# EAGLE design SparkFun_Qwiic_Micro_Barometer_LPS28DFW (EAGLE 9.6.2)
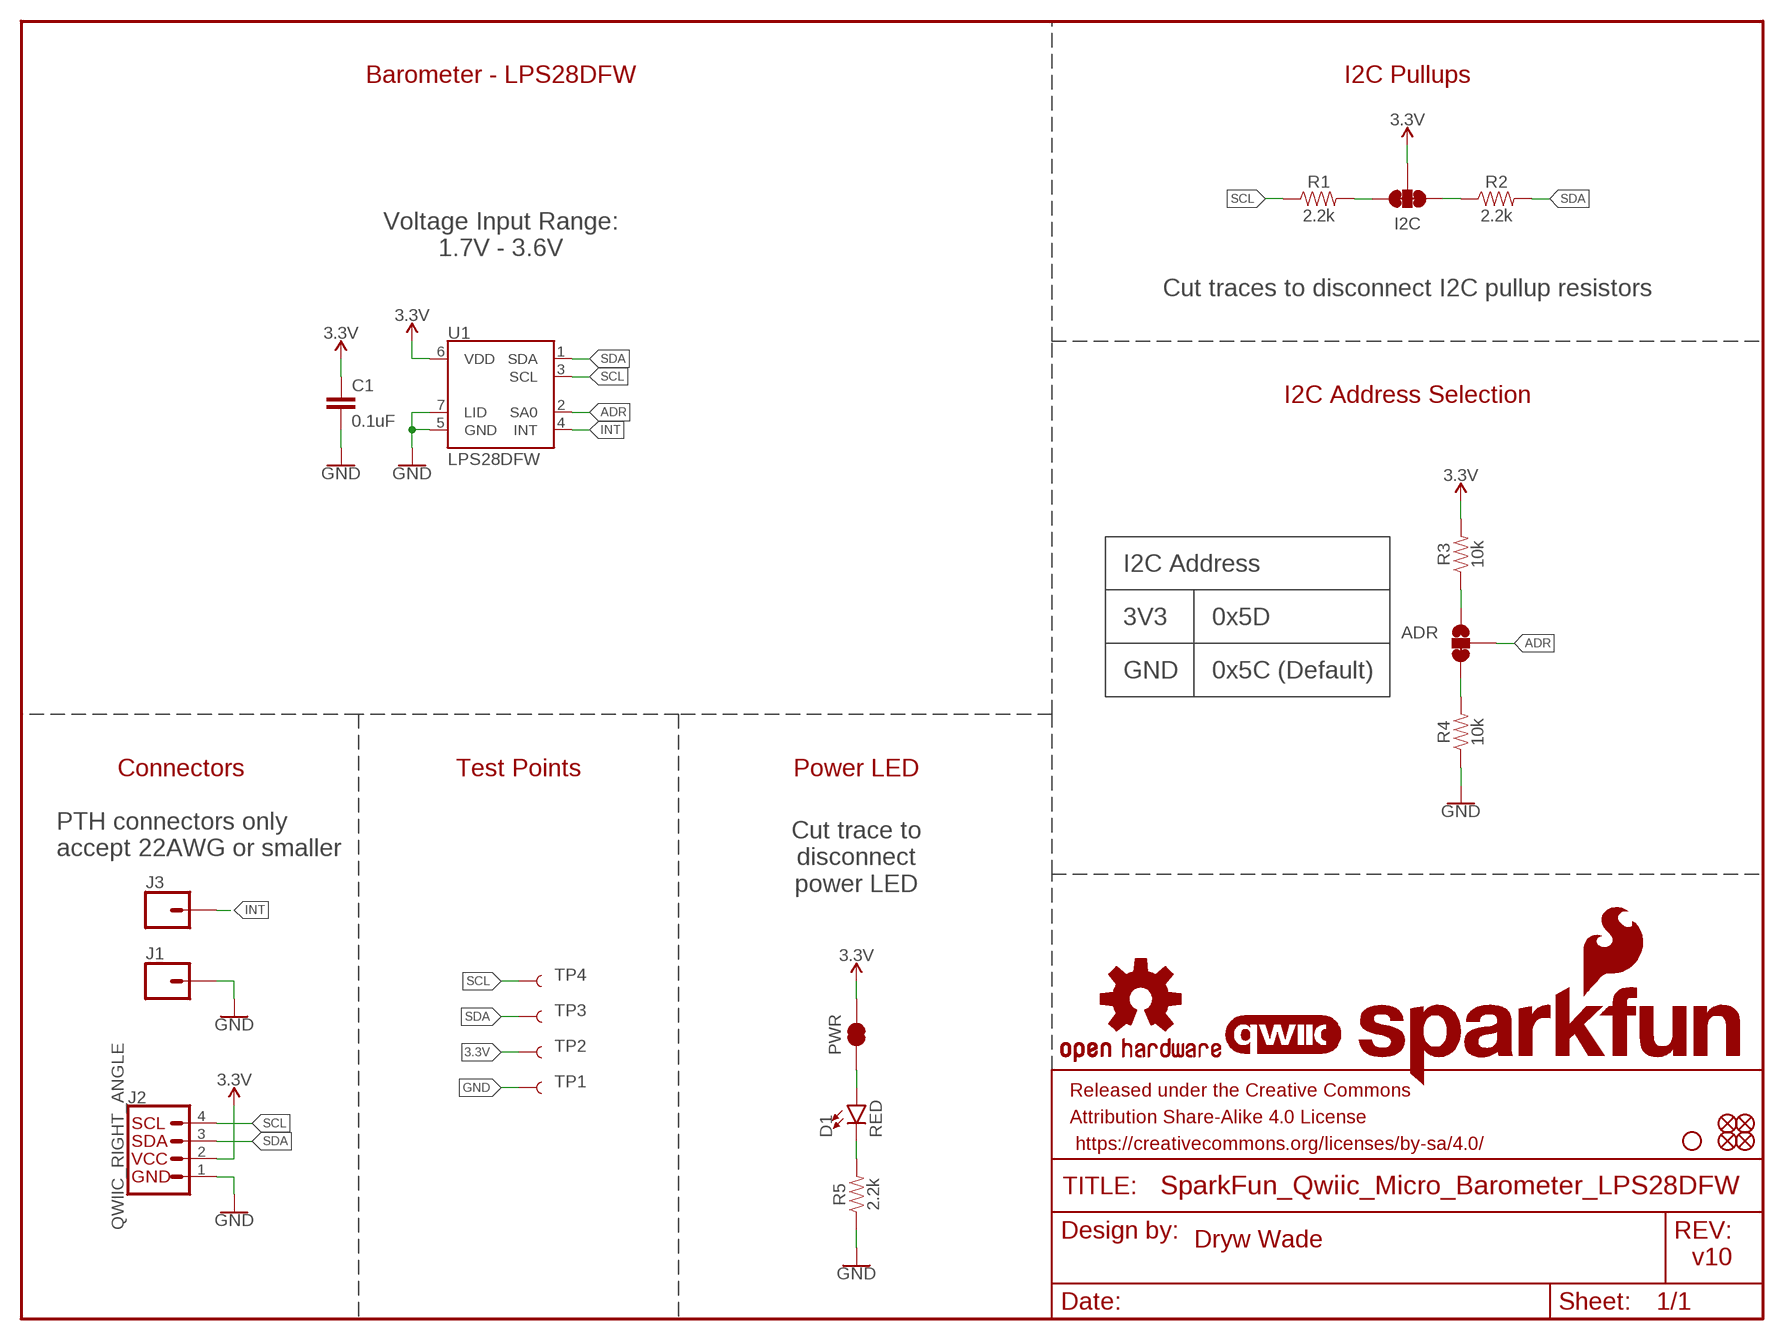
[diagram p0: schematic, sheet 1]

## Parts
ADR  JUMPER-SMT_3_1-NC_TRACE_SILK  [SMT-JUMPER_3_1-NC_TRACE_SILK]
C1  0.1uF  0.1UF-0402T-16V-10%  [0402-TIGHT]
D1  RED  LED-RED_0402  [LED-0402]
FD1  FIDUCIALUFIDUCIAL  [FIDUCIAL-MICRO]
FD2  FIDUCIALUFIDUCIAL  [FIDUCIAL-MICRO]
FD3  FIDUCIALUFIDUCIAL  [FIDUCIAL-MICRO]
FD4  FIDUCIALUFIDUCIAL  [FIDUCIAL-MICRO]
FRAME1  FRAME-LETTER  [CREATIVE_COMMONS]
H1  STAND-OFF  [STAND-OFF]
I2C  JUMPER-SMT_3_2-NC_TRACE_SILK  [SMT-JUMPER_3_2-NC_TRACE_SILK]
J1  CONN_01_1MM  [1X01_1MM_NO_SILK]
J2  QWIIC_RIGHT_ANGLE  QWIIC_CONNECTORJS-1MM  [JST04_1MM_RA]
J3  CONN_01_1MM  [1X01_1MM_NO_SILK]
LOGO1  OSHW-LOGOS  [OSHW-LOGO-S]
LOGO2  QWIIC_LOGO_3MM  [QWIIC_3MM]
LOGO3  SFE_LOGO_NAME_FLAMEBLANK  [BLANK]
PWR  JUMPER-SMT_2_NC_TRACE_SILK  [SMT-JUMPER_2_NC_TRACE_SILK]
R1  2.2k  2.2KOHM-0402T-1/16W-1%  [0402-TIGHT]
R2  2.2k  2.2KOHM-0402T-1/16W-1%  [0402-TIGHT]
R3  10k  10KOHM-0402T-1/16W-1%  [0402-TIGHT]
R4  10k  10KOHM-0402T-1/16W-1%  [0402-TIGHT]
R5  2.2k  2.2KOHM-0402T-1/16W-1%  [0402-TIGHT]
TP1  TEST-POINT3  [PAD.03X.03]
TP2  TEST-POINT3  [PAD.03X.03]
TP3  TEST-POINT3  [PAD.03X.03]
TP4  TEST-POINT3  [PAD.03X.03]
U1  LPS28DFW  [CCLGA-7L]

## Nets
3.3V: C1.1 I2C.2 J2.2 PWR.2 R3.2 TP2.1 U1.6(VDD)
ADR: ADR.2 U1.2(SA0)
GND: C1.2 J1.1 J2.1 R4.1 R5.1 TP1.1 U1.5(GND) U1.7(LID)
INT: J3.1 U1.4(INT)
N$1: D1.C R5.2
N$2: I2C.3 R1.2
N$3: I2C.1 R2.1
N$4: D1.A PWR.1
N$5: ADR.3 R4.2
N$6: ADR.1 R3.1
SCL: J2.4 R1.1 TP4.1 U1.3(SCL)
SDA: J2.3 R2.2 TP3.1 U1.1(SDA)

## Notes on the sheet
- Barometer - LPS28DFW | I2C Pullups
- Voltage Input Range:
  1.7V - 3.6V
- Cut traces to disconnect I2C pullup resistors
- I2C Address Selection
- I2C Address
- 3V3 | 0x5D
- GND | 0x5C (Default)
- Connectors | Test Points | Power LED
- PTH connectors only
  accept 22AWG or smaller
- Cut trace to
  disconnect
  power LED
- Dryw Wade
- v10

## Library data of the parts
ADR = SparkFun-Jumpers:JUMPER-SMT_3_1-NC_TRACE: Normally closed trace jumper (1 of 2 connections) This jumper has a trace between two pads so it's normally closed (NC). The other connection is normally open (NO). Use a razor knife to open the connection. For best results follow the IPC guidelines for cutting traces: Cutout at least 0.063 mm (0.005 in). Remove all loose material to clean up the cut area. Seal the cut with an approved epoxy. Reapply solder to reclose the connection, or to close the NO connection.
C1 = SparkFun-Capacitors:0.1UF: 0.1µF ceramic capacitors A capacitor is a passive two-terminal electrical component used to store electrical energy temporarily in an electric field.; PROD_ID: CAP-12416
D1 = SparkFun-LED:LED-RED: Red SMD LED Used in manufacturing of most products at SparkFun Packages: 0603 - SMD 0603 package [Product Link] <http://docs.avagotech.com/docs/AV02-0551EN> 0603 SMART - SMD 0603 SMART package ( more efficient and expensive)[Product Link] <http://www.osram-os.com/Graphics/XPic2/00077099_0.pdf> 1206 - SMD1206 package [Product Link] <https://www.sparkfun.com/datasheets/DevTools/LilyPad/Q150OVS4.pdff> SparkFun Products: Pro Mini 328 -5V <https://www.sparkfun.com/products/821> RedBoard <https://www.sparkfun.com/products/12757> IOIO-OTG <https://www.sparkfun.com/products/13613>; PROD_ID: DIO-16757
FD1-FD4 = SparkFun-Aesthetics:FIDUCIAL: Fiducial Alignment Points Point-of-reference for pick-and-place machines and other optical instruments.
FRAME1 = SparkFun-Aesthetics:FRAME-LETTER: Schematic Frame - Letter Standard 8.5x11 US Letter frame
H1 = SparkFun-Hardware:STAND-OFF: Stand Off Drill holes for mechanically mounting via screws, standoffs, etc. Note: Use the keepout ring to avoid running the screw head into surrounding components. Variant Overviews STAND-OFF - Mechanical footprint for a #4 phillips button head screw. STAND-OFF-TIGHT - Mechanical footprint for a #4 phillips button head screw, Example SparkFun Products Screw - Phillips Head (1/4", 4-40, 10 pack) <https://www.sparkfun.com/products/10453> (PRT-10453) Screw - Phillips Head (1/2", 4-40, 10 pack) <https://www.sparkfun.com/products/10452> (PRT-10452) Screw - Phillips Head (3/4", 4-40, 10 pack) <https://www.sparkfun.com/products/10451> (PRT-10451) Screw - Phillips Head (1", 4-40, 10 pack) <https://www.sparkfun.com/products/10450> (PRT-10450)
I2C = SparkFun-Jumpers:JUMPER-SMT_3_2-NC_TRACE: Normally closed trace jumper (2 of 2 connections) This jumper has a trace between all three pads so they are normally closed (NC). Use a razor knife to open the connection(s). For best results follow the IPC guidelines for cutting traces: Cutout at least 0.063 mm (0.005 in). Remove all loose material to clean up the cut area. Seal the cut with an approved epoxy. Reapply solder to reclose the connection(s).
J1 J3 = SparkFun-Connectors:CONN_01: Single connection point. Often used as Generic Header-pin footprint for 0.1 inch spaced/style header connections On any of the 0.1 inch spaced packages, you can populate with these: Break Away Headers - Straight <https://www.sparkfun.com/products/116> (PRT-00116) Break Away Male Headers - Right Angle <https://www.sparkfun.com/products/553> (PRT-00553) Female Headers <https://www.sparkfun.com/products/115> (PRT-00115) Break Away Headers - Machine Pin <https://www.sparkfun.com/products/117> (PRT-00117) Break Away Female Headers - Swiss Machine Pin <https://www.sparkfun.com/products/743> (PRT-00743) This device is also useful as a general connection point to wire up your design to another part of your project. Our various solder wires solder well into these plated through hole pads. Hook-Up Wire - Assortment (Stranded, 22 AWG) <https://www.sparkfun.com/products/11375> (PRT-11375) Hook-Up Wire - Assortment (Solid Core, 22 AWG) <https://www.sparkfun.com/products/11367> (PRT-11367) View the entire wire category on our website here <https://www.sparkfun.com/categories/141> Special notes: SMTSO-256-ET is a "flush mount" nut for a 4-40 screw. We mostly use this on specialty testbeds; it is a nice way to connect hardware to your PCB at an adjustable hieght. Also note, the SNAP packages are for using a snappable style connector. We sell a baggie of snaps and they are also used on two LilyPad designs: Snap Assortment - 30 pack (male and female) <https://www.sparkfun.com/products/11347> (DEV-11347) LilyPad Arduino SimpleSnap <https://www.sparkfun.com/products/10941> (DEV-10941) LilyPad SimpleSnap Protoboard <https://www.sparkfun.com/products/10940> (DEV-10940)
J2 = SparkFun-Connectors:QWIIC_CONNECTOR: SparkFun I2C Standard Qwiic Connector An SMD 1mm pitch JST connector makes it easy and quick (get it? Qwiic?) to connect I2C devices to each other. The Qwiic system <http://www.sparkfun.com/qwiic> enables fast and solderless connection between popular platforms and various sensors and actuators. We carry 200mm <https://www.sparkfun.com/products/14204>, 100mm <https://www.sparkfun.com/products/14205>, 50mm <https://www.sparkfun.com/products/14206>, and breadboard friendly <https://www.sparkfun.com/products/14207> Qwiic cables. We also offer 10 pcs strips <https://www.sparkfun.com/products/14323> the SMD connectors.; PROD_ID: CONN-13694
LOGO1 = SparkFun-Aesthetics:OSHW-LOGO: Open-Source Hardware (OSHW) Logo This logo indicates the piece of hardware it is found on incorporates a OSHW license and/or adheres to the definition of open source hardware found here: http://freedomdefined.org/OSHW
LOGO2 = SparkFun-Aesthetics:QWIIC_LOGO: Qwiic Logos for placement on schematic and PCB. The 5.5mm silk logo is best for placing next to Qwiic connector.
LOGO3 = SparkFun-Aesthetics:SFE_LOGO_NAME_FLAME: SparkFun Font Logo w/ Flame This is the SparkFun full logo. The logo on the schematic will always be the same size; the package variant is the height of the flame part of the logo. Default layer for the logo on the board is tSilk.
PWR = SparkFun-Jumpers:JUMPER-SMT_2_NC_TRACE: Normally closed trace jumper This jumper has a trace between two pads so it's normally closed (NC). Use a razor knife to open the connection. For best results follow the IPC guidelines for cutting traces: Cutout at least 0.063 mm (0.005 in). Remove all loose material to clean up the cut area. Seal the cut with an approved epoxy. Reapply solder to reclose the connection.
R1 R2 R5 = SparkFun-Resistors:2.2KOHM: 2.2kΩ resistor A resistor is a passive two-terminal electrical component that implements electrical resistance as a circuit element. Resistors act to reduce current flow, and, at the same time, act to lower voltage levels within circuits. - Wikipedia; PROD_ID: RES-14341
R3 R4 = SparkFun-Resistors:10KOHM: 10kΩ resistor A resistor is a passive two-terminal electrical component that implements electrical resistance as a circuit element. Resistors act to reduce current flow, and, at the same time, act to lower voltage levels within circuits. - Wikipedia; PROD_ID: RES-14241
TP1-TP4 = SparkFun-Connectors:TEST-POINT: SparkFun Test Points Bare copper test points for troubleshooting or In-Circuit-Testing. These are used by our Production team for verifying production board runs using pogo-pins on test beds. SparkFun Products: SparkFun LSM9DS1 Breakout <https://www.sparkfun.com/products/13284> SparkFun PSOC <https://www.sparkfun.com/products/13714> SparkFun Load Cell Amplifier <https://www.sparkfun.com/products/13879>
U1 = SparkFun-Sensors:LPS28DFW; PROD_ID: IC-17197

## Board
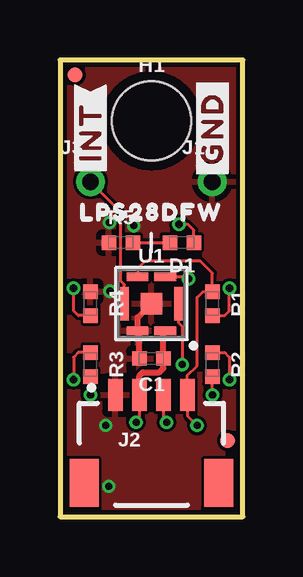
[diagram p1: board, top side]
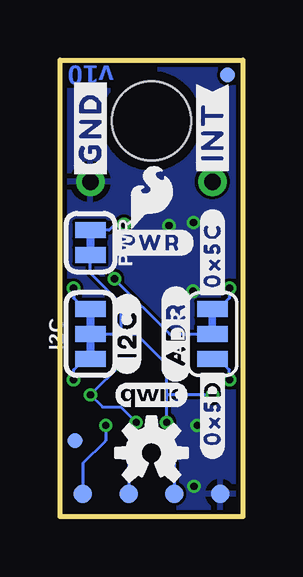
[diagram p2: board, bottom side, seen from below]

Size 7.62 x 19.05 mm. Coordinates in mm from the lower left corner, seen from the top.
Outline: 0,0 7.62,0 7.62,19.05 0,19.05 0,0
Copper layers (1*16): Top 0.035mm / dielectric 1.5mm / Bottom 0.035mm
Design rules "SparkFun-2-Layer-Minimum-JLCPCB": minimum track width 5mil, minimum drill 0.3mm, track to track 5mil, track to pad 5mil, pad to pad 5mil, via to via 5mil, smd to smd 5mil, copper to edge 7mil, drill to drill 7mil, minimum pad ring 5mil, minimum via ring 5mil, stop-mask expansion 2.5mil, vias tented up to drill 25mil, thermal gap 10mil

### Footprints (pad centres in the part's own frame; a part is rotated, then mirrored left to right if it is on the bottom)
SMT-JUMPER_3_1-NC_TRACE_SILK = smd 0.66 x 1.27: 1 -1.041,0; 2 0,0; 3 1.041,0
0402-TIGHT = smd 0.6 x 0.6: 1 -0.5,0; 2 0.5,0
LED-0402 = smd 0.6 x 0.6: A -0.5,0; C 0.5,0
FIDUCIAL-MICRO = smd 0.635 x 0.635: 1 0,0
STAND-OFF = hole 3.302: 0,0
SMT-JUMPER_3_2-NC_TRACE_SILK = smd 0.66 x 1.27: 1 -1.041,0; 2 0,0; 3 1.041,0
1X01_1MM_NO_SILK = drill 0.7 pad 1.2: 1 0,0
JST04_1MM_RA = smd 0.6 x 1.35: 1 -1.5,0; 2 -0.5,0; 3 0.5,0; 4 1.5,0 | smd 1.2 x 2: NC1 2.8,-3.675; NC2 -2.8,-3.675
SMT-JUMPER_2_NC_TRACE_SILK = smd 0.66 x 1.27: 1 -0.521,0; 2 0.521,0
PAD.03X.03 = smd 0.762 x 0.762: 1 0,0
CCLGA-7L = smd 0.35 x 1.4: 1 1.125,0; 4 -1.125,0 | smd 0.9 x 0.35: 2 0.575,1.125; 3 -0.575,1.125; 5 -0.575,-1.125; 6 0.575,-1.125 | smd 0.9 x 0.9: 7 0,0

### Placement (x,y rotation side)
ADR  1.27,7.62 90 bottom
C1  3.81,6.6 180 top
D1  5.08,11.43 180 top
FD1  6.99,3.17 0 bottom
FD2  6.99,3.17 0 top
FD3  0.64,18.41 0 bottom
FD4  0.64,18.41 0 top
FRAME1  -19.05,-13.97 0 top  (outside the outline)
H1  3.81,16.51 0 top
I2C  6.35,7.62 90 bottom
J1  6.35,13.97 0 top
J2  3.81,5.08 0 top
J3  1.27,13.97 0 top
LOGO1  3.81,2.67 0 bottom
LOGO2  3.81,5.08 0 bottom
LOGO3  -19.05,-16.51 0 top  (outside the outline)
PWR  6.35,11.43 270 bottom
R1  6.35,8.89 270 top
R2  6.35,6.35 270 top
R3  1.27,6.35 270 top
R4  1.27,8.89 270 top
R5  2.54,11.43 0 top
TP1  0.95,0.95 90 bottom
TP2  2.86,0.95 90 bottom
TP3  4.76,0.95 90 bottom
TP4  6.67,0.95 90 bottom
U1  3.81,8.89 0 top
U$1  [#INT#0]  1.27,14.1 90 top
U$2  [#GND#0]  6.35,13.97 90 top
U$3  [#INT#0]  1.27,14.1 90 bottom
U$4  [#GND#0]  6.35,13.97 90 bottom
U$5  [LPS28DFW0]  3.81,12.7 0 top
U$6  [SFE_LOGO_FLAME_.1]  3.81,13.34 0 bottom
U$9  [#I2C#0]  4.83,7.62 90 bottom
U$10  [#ADR#0]  2.79,7.62 90 bottom
U$13  [#PWR#0]  5.59,11.43 0 bottom
U$16  [#0X5D#0]  1.27,6.22 90 bottom
U$17  [#0X5C#0]  1.27,9.02 90 bottom
U$19  [ORDERING_INSTRUCTIONS]  16.51,50.8 0 top  (outside the outline)

### Tracks (layer width: path | path; a pad name or v marks a point on that pad's centre or on a via)
3.3V  (via drill 0.3)
  Top 0.127: J2.2 3.31,4.07 v3.17,3.94 | v1.27,5.08 R3.2
  Top 0.254: U1.6 4.31,7.69 C1.1 4.31,6.19 4.14,6.03 3.45,6.03 3.31,5.88 J2.2
  Bottom 0.127: TP2.1 2.86,2.22 3.17,2.54 v3.17,3.94 3.17,5.08 | I2C.2 5.08,7.62 | 5.08,7.62 5.08,8.89 6.35,10.16 PWR.2 | 3.17,5.08 3.17,6.35 4.45,7.62 5.08,7.62 | v1.27,5.08 3.17,5.08
ADR  (via drill 0.3)
  Top 0.127: U1.2 5.26,10.02 v5.35,9.92
  Bottom 0.127: v5.35,9.92 3.05,7.62 ADR.2
GND  (via drill 0.3)
  Top 0.254: U1.7 3.23,8.31 U1.5 3.31,7.69 C1.2
  other vias: 1.91,3.81 2.03,1.27 2.08,9.4 2.06,12.27 3.07,12.14
  pour Top (isolate 0.127): 0,0 7.62,0 7.62,19.05 0,19.05
  pour Bottom (isolate 0.127): 0,0 7.62,0 7.62,19.05 0,19.05
INT
  Top 0.127: U1.4 2.69,9.68 2.54,9.82 2.54,12.7 J3.1
N$1
  Top 0.127: R5.2 D1.C
N$2  (via drill 0.3)
  Top 0.127: R1.2 6.86,8.39 7.06,8.59 v7.06,9.53
  Bottom 0.127: v7.06,9.53 7.06,9.11 6.6,8.66 I2C.3
N$3  (via drill 0.3)
  Top 0.127: R2.1 6.86,6.85 7.06,6.65 v7.06,5.71
  Bottom 0.127: v7.06,5.71 7.06,6.13 6.6,6.58 I2C.1
N$4  (via drill 0.3)
  Top 0.127: D1.A 5.58,11.95 5.33,12.19 v4.95,12.19
  Bottom 0.127: v4.95,12.19 5.33,12.19 5.58,11.95 PWR.1
N$5  (via drill 0.3)
  Top 0.127: R4.2 0.76,8.39 0.56,8.59 v0.56,9.53
  Bottom 0.127: v0.56,9.53 0.56,9.11 1.02,8.66 ADR.3
N$6  (via drill 0.3)
  Top 0.127: R3.1 0.76,6.85 0.56,6.65 v0.56,5.71
  Bottom 0.127: v0.56,5.71 0.56,6.13 1.02,6.58 ADR.1
SCL  (via drill 0.3)
  Top 0.127: v5.71,3.81 5.31,4.21 J2.4 5.31,5.89 5.71,6.3 5.71,9.14 5.96,9.39 R1.1 6.35,10.16 5.84,10.67 3.56,10.67 3.23,10.35 U1.3
  Bottom 0.127: v5.71,3.81 5.71,3.17 6.67,2.22 TP4.1
SDA  (via drill 0.3)
  Top 0.127: J2.3 4.31,4.07 v4.45,3.94 | v6.35,5.08 R2.2 | U1.1 4.93,8.1 5.09,7.95 v5.09,6.35
  Bottom 0.127: TP3.1 4.76,2.22 4.45,2.54 v4.45,3.94 5.08,4.57 5.84,4.57 v6.35,5.08 5.09,6.34 v5.09,6.35

### Text on the board
Bottom: v10
Measures: Units: inches
tDocu: 2-Layer | 1.6mm Thickness | Lead-Free HASL | Dryw Wade